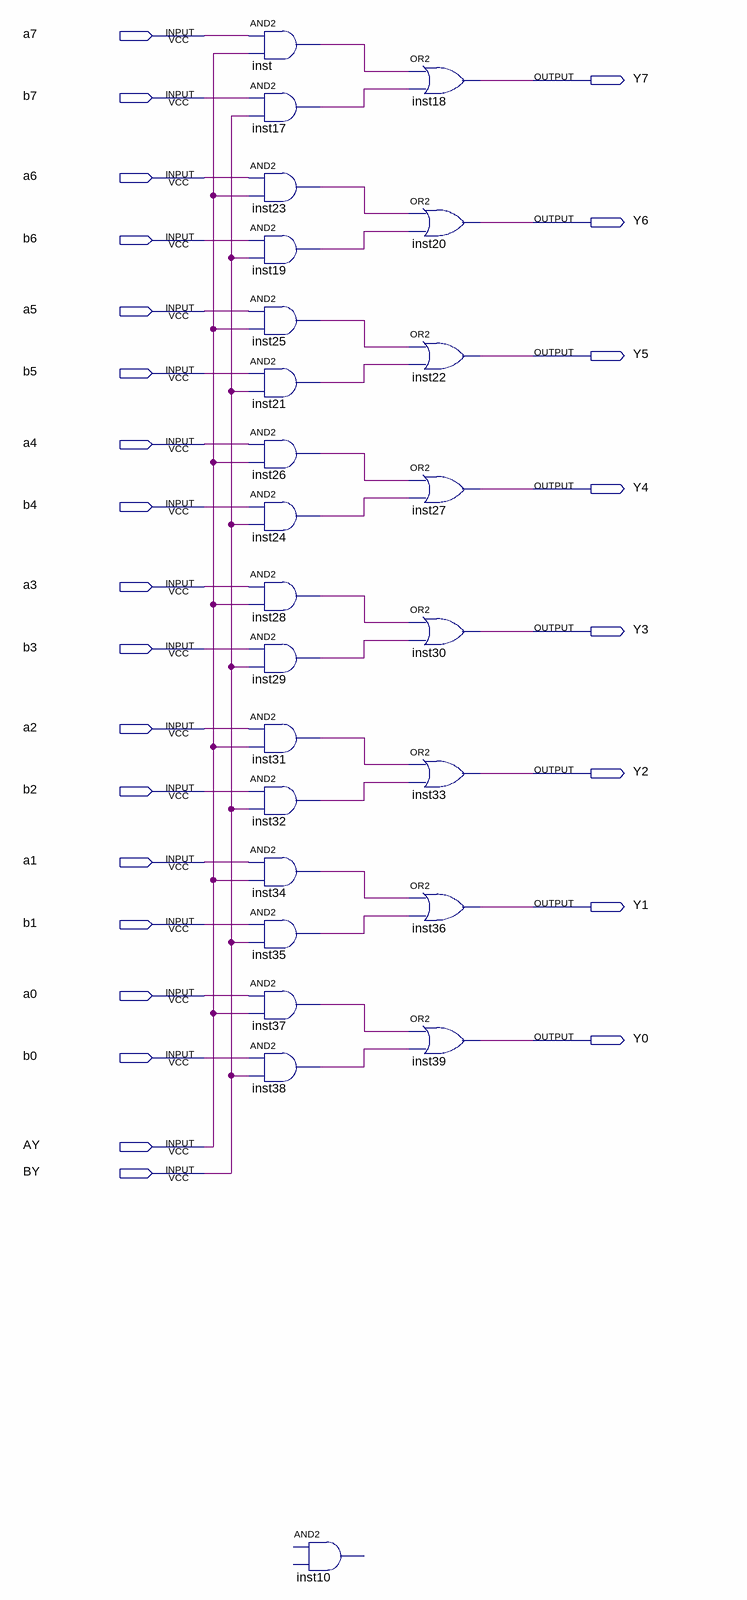
[diagram p0: schematic sheet]
// Quartus schematic Exper1.bdf as structural Verilog: 25 symbols, 26 pins
module Exper1 (
  input  a7,
  input  b7,
  input  a6,
  input  b6,
  input  a5,
  input  b5,
  input  a4,
  input  b4,
  input  a3,
  input  b3,
  input  a2,
  input  b2,
  input  a1,
  input  b1,
  input  a0,
  input  b0,
  input  AY,
  input  BY,
  output Y7,
  output Y6,
  output Y5,
  output Y4,
  output Y3,
  output Y2,
  output Y1,
  output Y0
);

  wire inst17_out, inst19_out, inst21_out, inst23_out, inst24_out, inst25_out, inst26_out, inst28_out,
       inst29_out, inst31_out, inst32_out, inst34_out, inst35_out, inst37_out, inst38_out, inst_out;

  and inst (inst_out, a7, AY);
  and inst17 (inst17_out, b7, BY);
  and inst23 (inst23_out, a6, AY);
  and inst19 (inst19_out, b6, BY);
  and inst25 (inst25_out, a5, AY);
  and inst21 (inst21_out, b5, BY);
  and inst26 (inst26_out, a4, AY);
  and inst24 (inst24_out, b4, BY);
  and inst28 (inst28_out, a3, AY);
  and inst29 (inst29_out, b3, BY);
  and inst31 (inst31_out, a2, AY);
  and inst32 (inst32_out, b2, BY);
  and inst34 (inst34_out, a1, AY);
  and inst35 (inst35_out, b1, BY);
  and inst37 (inst37_out, a0, AY);
  and inst38 (inst38_out, b0, BY);
  // AND2 inst10 is placed but not wired
  or inst18 (Y7, inst_out, inst17_out);
  or inst20 (Y6, inst23_out, inst19_out);
  or inst22 (Y5, inst25_out, inst21_out);
  or inst27 (Y4, inst26_out, inst24_out);
  or inst30 (Y3, inst28_out, inst29_out);
  or inst33 (Y2, inst31_out, inst32_out);
  or inst36 (Y1, inst34_out, inst35_out);
  or inst39 (Y0, inst37_out, inst38_out);
endmodule
